# EAGLE design rfm69-spi (EAGLE 9.6.2)
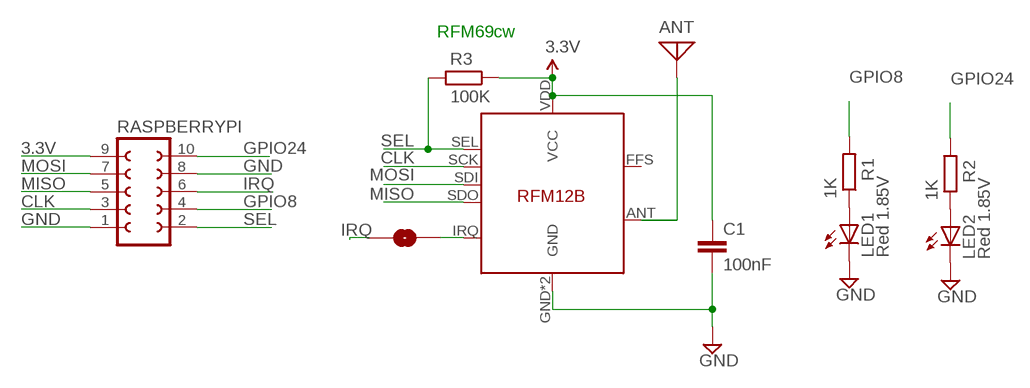
[diagram p0: schematic, sheet 1]

## Parts
ANT  ANTENNA  [PAD-01]
C1  100nF  C-EUC0603  [C0603]
GPIO15  SOLDERJUMPERNO  [SJ_2S-NO]
LED1  Red 1.85V  LEDCHIP-LED0805  [CHIP-LED0805]
LED2  Red 1.85V  LEDCHIP-LED0805  [CHIP-LED0805]
R1  1K  R-EU_R0603  [R0603]
R2  1K  R-EU_R0603  [R0603]
R3  100K  R-EU_R0603  [R0603]
RASPBERRYPI  FE05-2  [FE05-2]
U$14  RFM12B  [RFM12B]

## Nets
3.3V: C1.1 R3.1 RASPBERRYPI.9 U$14.VDD(VCC)
CLK: RASPBERRYPI.3 U$14.SCK
DIG1: ANT.1 U$14.ANT
GND [power]: C1.2 LED1.C LED2.C RASPBERRYPI.1 RASPBERRYPI.8 U$14.GND U$14.P$12(GND)
GPIO8: R1.2 RASPBERRYPI.4
GPIO24: R2.2 RASPBERRYPI.10
IRQ: GPIO15.2 RASPBERRYPI.6
MISO: RASPBERRYPI.5 U$14.SDO
MOSI: RASPBERRYPI.7 U$14.SDI
N$1: LED2.A R2.1
N$2: GPIO15.1 U$14.IRQ
N$41: LED1.A R1.1
SEL: R3.2 RASPBERRYPI.2 U$14.SEL
Unconnected: U$14.FFS

## Notes on the sheet
- RFM69cw

## Library data of the parts
ANT = discrete:ANTENNA: Antenna
C1 = resistor:C-EU: CAPACITOR, European symbol
GPIO15 = SparkFun:SOLDERJUMPER: Solder Jumper Standard SMD solder jumper. Used to automate production. Two varients : Normally Open and Normally Closed are the same, but have different paste layers. NC will have a large amount of paste and should jumper during reflow.
LED1 LED2 = adafruit:LED: LED OSRAM: - CHIPLED LG R971, LG N971, LY N971, LG Q971, LY Q971, LO R971, LY R971 LH N974, LH R974 LS Q976, LO Q976, LY Q976 LO Q996 - Hyper CHIPLED LW Q18S LB Q993, LB Q99A, LB R99A - SideLED LS A670, LO A670, LY A670, LG A670, LP A670 LB A673, LV A673, LT A673, LW A673 LH A674 LY A675 LS A676, LA A676, LO A676, LY A676, LW A676 LS A679, LY A679, LG A679 - Hyper Micro SIDELED® LS Y876, LA Y876, LO Y876, LY Y876 LT Y87S - SmartLED LW L88C, LW L88S LB L89C, LB L89S, LG L890 LS L89K, LO L89K, LY L89K LS L896, LA L896, LO L896, LY L896 - TOPLED LS T670, LO T670, LY T670, LG T670, LP T670 LSG T670, LSP T670, LSY T670, LOP T670, LYG T670 LG T671, LOG T671, LSG T671 LB T673, LV T673, LT T673, LW T673 LH T674 LS T676, LA T676, LO T676, LY T676, LB T676, LH T676, LSB T676, LW T676 LB T67C, LV T67C, LT T67C, LS T67K, LO T67K, LY T67K, LW E67C LS E67B, LA E67B, LO E67B, LY E67B, LB E67C, LV E67C, LT E67C LW T67C LS T679, LY T679, LG T679 LS T770, LO T770, LY T770, LG T770, LP T770 LB T773, LV T773, LT T773, LW T773 LH T774 LS E675, LA E675, LY E675, LS T675 LS T776, LA T776, LO T776, LY T776, LB T776 LHGB T686 LT T68C, LB T68C - Hyper Mini TOPLED® LB M676 - Mini TOPLED Santana® LG M470 LS M47K, LO M47K, LY M47K Source: http://www.osram.convergy.de/
R1-R3 = rcl:R-EU_: RESISTOR, European symbol
RASPBERRYPI = con-lsta:FE05-2: FEMALE HEADER; OC_FARNELL: unknown; OC_NEWARK: unknown
U$14 = JeeParts:RFM12B

## Net classes
0 default: width 0.203 mm, drill 0.6 mm, clearance 0.203 mm
1 power: width 0.381 mm, drill 0.6 mm, clearance 0.254 mm
2 gnd: width 0.254 mm, drill 0.6 mm, clearance 0.254 mm

## Board
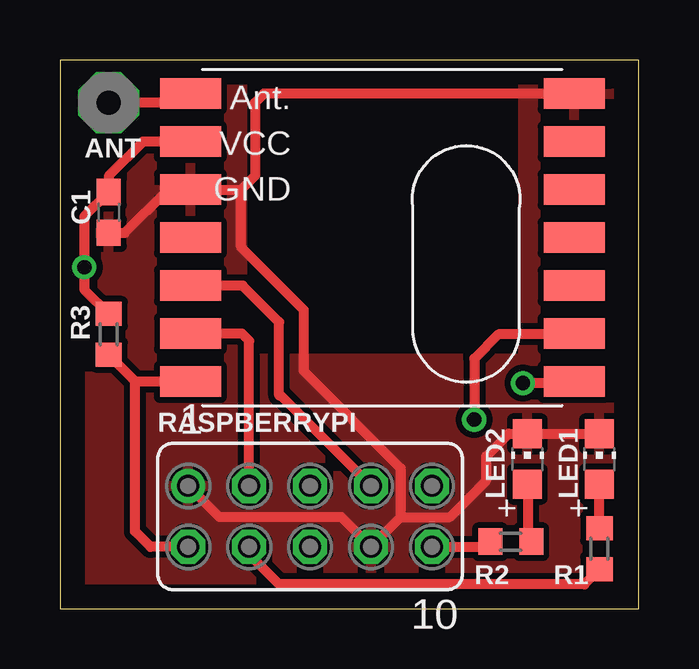
[diagram p1: board, top side]
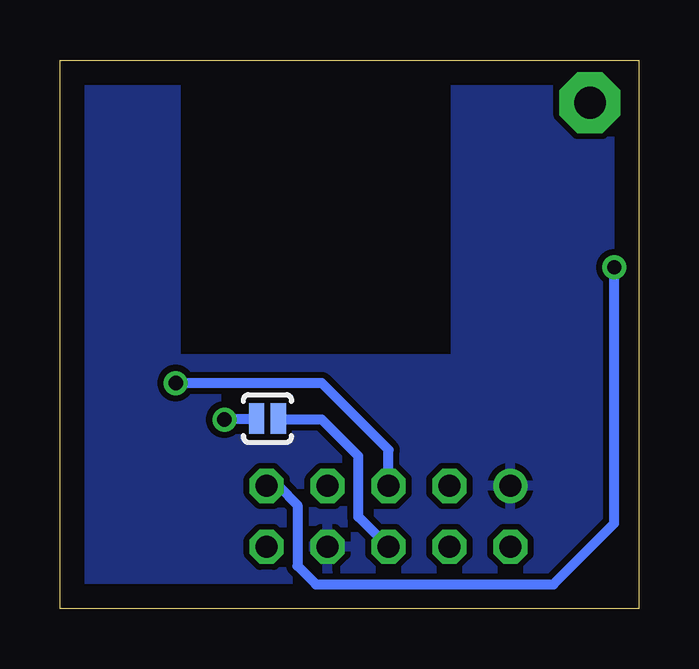
[diagram p2: board, bottom side, seen from below]

Size 24.13 x 22.86 mm. Coordinates in mm from the lower left corner, seen from the top.
Outline: 0,0 24.13,0 24.13,22.86 0,22.86 0,0
Copper layers (1*16): Top 0.035mm / dielectric 1.5mm / Bottom 0.035mm
Design rules "default *": minimum track width 6mil, minimum drill 0.35mm, track to track 6mil, track to pad 6mil, pad to pad 6mil, via to via 6mil, smd to smd 6mil, copper to edge 40mil, drill to drill 6mil, minimum pad ring 10mil, minimum via ring 8mil, stop-mask expansion 4mil, vias tented up to drill 0.6mm, thermal gap 10mil

### Footprints (pad centres in the part's own frame; a part is rotated, then mirrored left to right if it is on the bottom)
PAD-01 = drill 1.321 pad 2.54 octagon: 1 0,0
C0603 = smd 1.1 x 1: 1 -0.85,0; 2 0.85,0
SJ_2S-NO = smd 0.635 x 1.27: 1 -0.45,0; 2 0.45,0
CHIP-LED0805 = smd 1.2 x 1.2: A 0,-1.05; C 0,1.05
R0603 = smd 1 x 1.1: 1 -0.85,0; 2 0.85,0
FE05-2 = drill 0.914: 1 -5.08,1.27 | drill 0.914 octagon: 2 -5.08,-1.27; 3 -2.54,1.27; 4 -2.54,-1.27; 5 0,1.27; 6 0,-1.27; 7 2.54,1.27; 8 2.54,-1.27; 9 5.08,1.27; 10 5.08,-1.27
RFM12B = smd 2.54 x 1.27: ANT 8,-6; FFS -8,2; GND 8,-2; IRQ -8,4; P$8 -8,0; P$9 -8,-2; P$10 -8,-4; P$12 -8,-6; P$16 8,0; SCK 8,4; SDI 8,2; SDO -8,6; SEL 8,6; VDD 8,-4

### Placement (x,y rotation side)
ANT  2.03,21.08 0 top
C1  2.03,16.51 270 top
GPIO15  15.48,7.92 0 bottom
LED1  22.49,6.24 0 top
LED2  19.49,6.24 0 top
R1  22.49,2.49 270 top
R2  18.8,2.79 180 top
R3  2.03,11.43 270 top
RASPBERRYPI  10.43,3.84 0 top
U$14  13.45,15.46 180 top

### Tracks (layer width: path | path; a pad name or v marks a point on that pad's centre or on a via)
3.3V  (via drill 0.6)
  Top 0.406: U$14.VDD 3.46,19.46 2.03,18.03 C1.1 1.02,16.34 v1.02,14.22 1.02,13.3 R3.1
  Bottom 0.406: RASPBERRYPI.9 15.02,5.11 14.22,4.32 14.22,1.78 13.46,1.02 3.56,1.02 1.02,3.56 v1.02,14.22
CLK
  Top 0.406: RASPBERRYPI.3 7.89,11.16 7.59,11.46 U$14.SCK
DIG1
  Top 0.406: U$14.ANT 5.07,21.08 ANT.1
GND
  Top 0.406: C1.2 2.71,15.66 4.51,17.46 U$14.GND 7.56,17.46 | U$14.P$12 8.51,21.46 8.13,21.08 8.13,18.03 7.56,17.46 | LED1.C LED2.C 18.72,7.29 17.78,6.35 17.78,5.33 16.26,3.81 14.21,3.81 | 14.21,3.81 RASPBERRYPI.8 11.73,3.81 6.65,3.81 RASPBERRYPI.1 | 14.21,3.81 14.21,5.86 10.16,9.91 10.16,12.45 7.56,15.05 7.56,17.46
  pour Bottom: 0,22.86 0,0 24.13,0 24.13,22.86 19.3,22.86 19.3,10.41 7.62,10.41 7.62,22.86
  pour Top: 0.25,22.86 0.25,0 24.13,0 24.13,22.86 19.3,22.86 19.3,10.41 7.62,10.41 7.62,22.86
GPIO8
  Top 0.406: R1.2 21.87,1.02 9.14,1.02 7.89,2.27 RASPBERRYPI.4
GPIO24
  Top 0.406: RASPBERRYPI.10 17.72,2.57 R2.2
IRQ
  Bottom 0.406: RASPBERRYPI.6 11.67,3.81 11.68,3.81 11.68,6.35 13.21,7.87 14.98,7.87 GPIO15.2
MISO  (via drill 0.6)
  Top 0.406: U$14.SDO 21.38,9.4 v19.3,9.4
  Bottom 0.406: RASPBERRYPI.5 10.43,6.62 13.21,9.4 v19.3,9.4
MOSI
  Top 0.406: RASPBERRYPI.7 9.19,8.89 9.14,8.89 9.14,11.94 7.62,13.46 U$14.SDI
N$1
  Top 0.406: LED2.A 19.54,5.14 19.54,2.9 R2.1
N$2  (via drill 0.6)
  Top 0.406: U$14.IRQ 21.41,11.43 18.29,11.43 17.27,10.41 v17.27,7.87
  Bottom 0.406: GPIO15.1 17.22,7.92 v17.27,7.87
N$41
  Top 0.406: R1.1 LED1.A
SEL
  Top 0.406: 3.13,9.48 3.15,9.46 U$14.SEL | 3.13,9.48 R3.2 | RASPBERRYPI.2 3.78,2.57 3.13,3.22 3.13,9.48